# EAGLE design D12_1_0 (EAGLE 8.3.2)
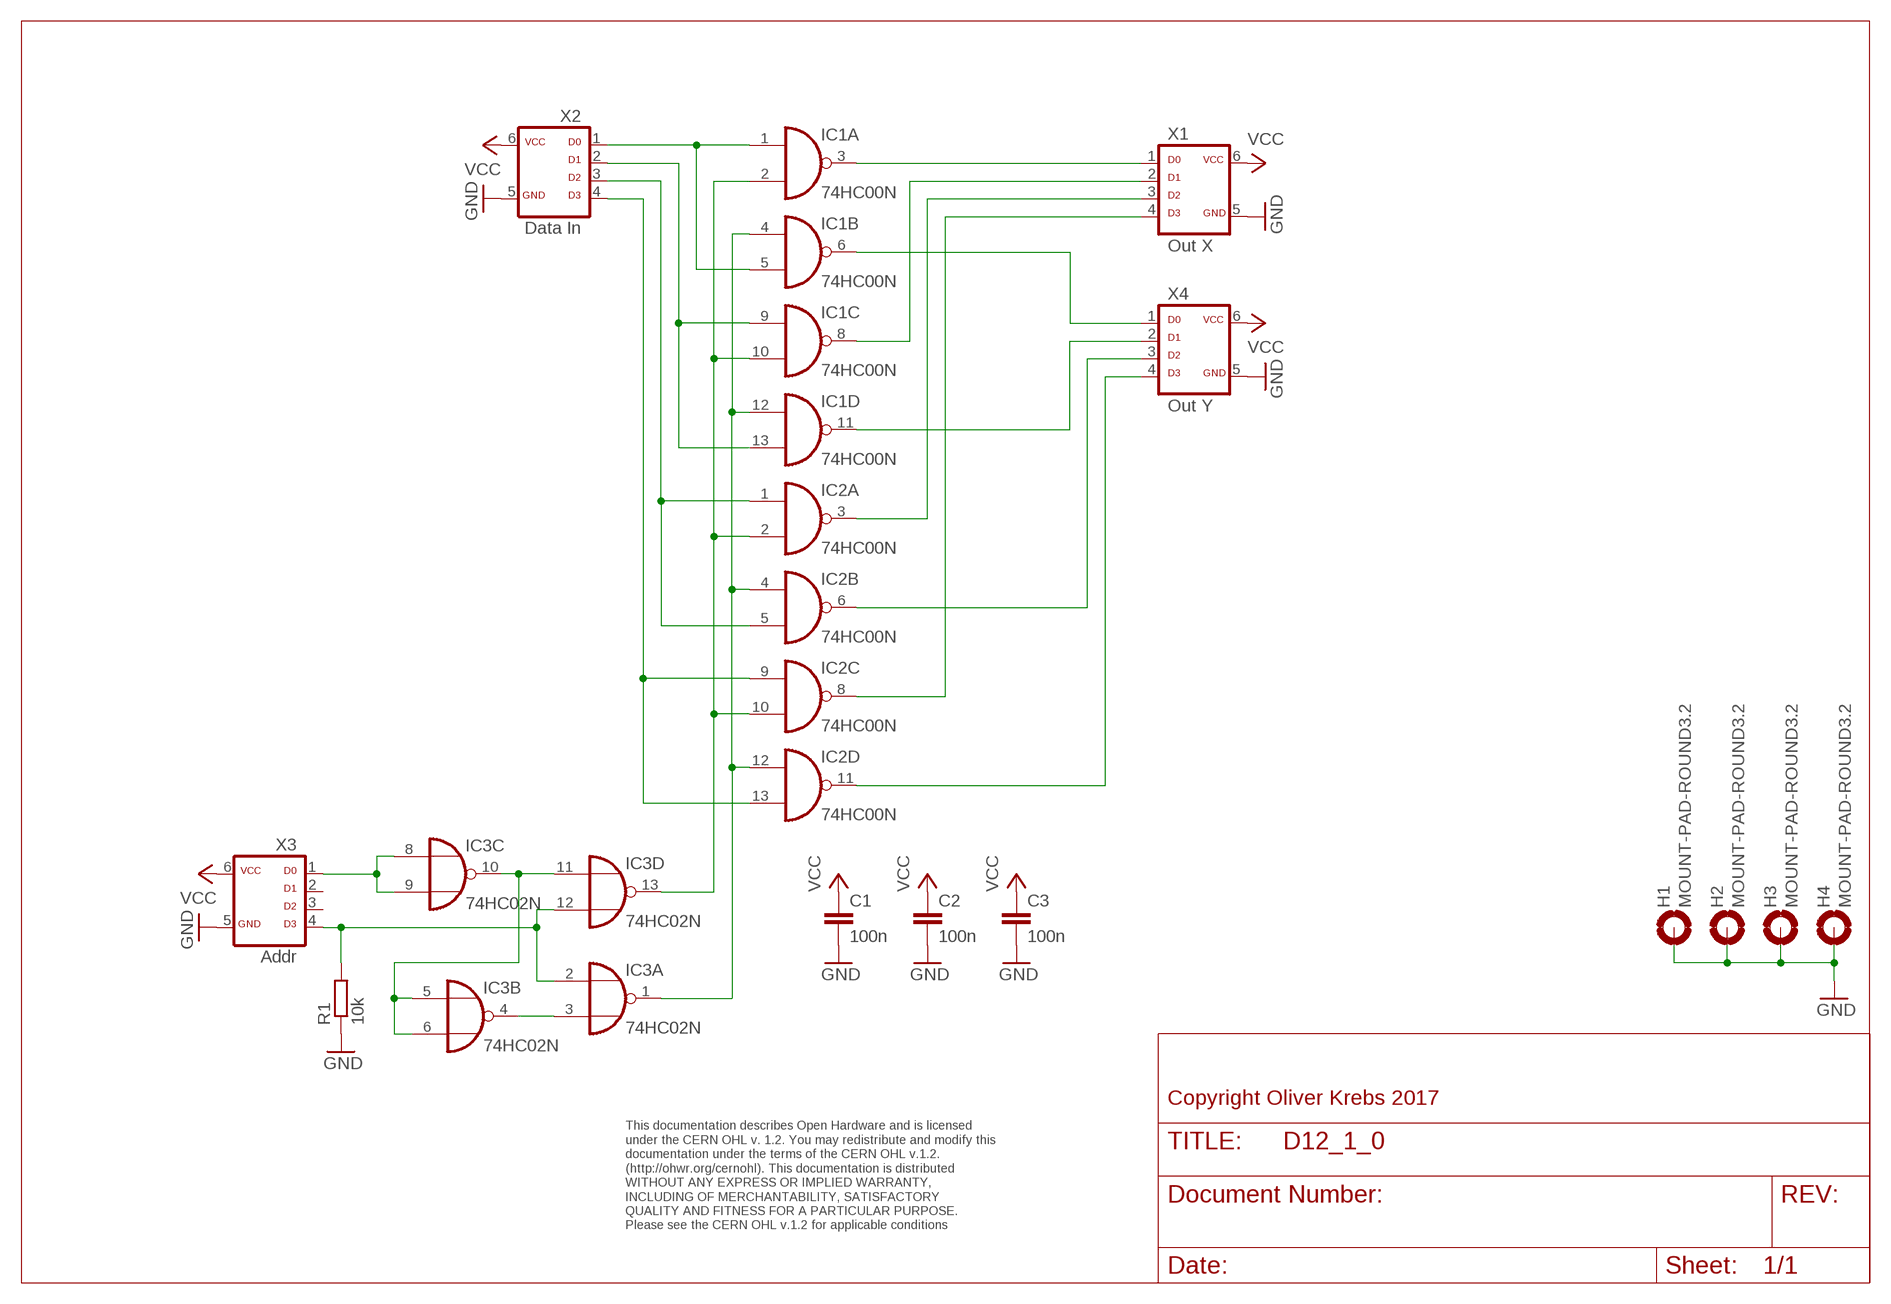
[diagram p0: schematic, sheet 1]

## Parts
C1  100n  C-EU050-025X075  [C050-025X075]
C2  100n  C-EU050-025X075  [C050-025X075]
C3  100n  C-EU050-025X075  [C050-025X075]
H1  MOUNT-PAD-ROUND3.2  [3,2-PAD]
H2  MOUNT-PAD-ROUND3.2  [3,2-PAD]
H3  MOUNT-PAD-ROUND3.2  [3,2-PAD]
H4  MOUNT-PAD-ROUND3.2  [3,2-PAD]
IC1  74HC00N  [DIL14]
IC2  74HC00N  [DIL14]
IC3  74HC02N  [DIL14]
R1  10k  R-EU_0207/10  [0207/10]
X1  Out X  ML6D  [ML-6]
X2  Data In  ML6D  [ML-6]
X3  Addr  ML6D  [ML-6]
X4  Out Y  ML6D  [ML-6]

## Nets
GND: C1.2 C2.2 C3.2 H1.B3,2(MOUNT) H2.B3,2(MOUNT) H3.B3,2(MOUNT) H4.B3,2(MOUNT) R1.1 X1.5 X2.5 X3.5 X4.5
N$1: IC1.3(A:O) X1.1
N$2: IC1.8(C:O) X1.2
N$3: IC2.3(A:O) X1.3
N$4: IC1.1(A:I0) IC1.5(B:I1) X2.1
N$5: IC1.9(C:I0) IC1.13(D:I1) X2.2
N$6: IC2.1(A:I0) IC2.5(B:I1) X2.3
N$7: IC2.9(C:I0) IC2.13(D:I1) X2.4
N$8: IC2.8(C:O) X1.4
N$9: IC1.6(B:O) X4.1
N$10: IC1.11(D:O) X4.2
N$11: IC2.6(B:O) X4.3
N$12: IC2.11(D:O) X4.4
N$13: IC3.5(B:I0) IC3.6(B:I1) IC3.10(C:O) IC3.11(D:I0)
N$14: IC3.2(A:I0) IC3.12(D:I1) R1.2 X3.4
N$15: IC1.2(A:I1) IC1.10(C:I1) IC2.2(A:I1) IC2.10(C:I1) IC3.13(D:O)
N$16: IC1.4(B:I0) IC1.12(D:I0) IC2.4(B:I0) IC2.12(D:I0) IC3.1(A:O)
N$17: IC3.3(A:I1) IC3.4(B:O)
N$19: IC3.8(C:I0) IC3.9(C:I1) X3.1
VCC: C1.1 C2.1 C3.1 X1.6 X2.6 X3.6 X4.6
Unconnected: X3.2 X3.3

## Notes on the sheet
- Copyright Oliver Krebs 2017
- This documentation describes Open Hardware and is licensed 
  under the CERN OHL v. 1.2. You may redistribute and modify this 
  documentation under the terms of the CERN OHL v.1.2. 
  (http://ohwr.org/cernohl). This documentation is distributed
  WITHOUT ANY EXPRESS OR IMPLIED WARRANTY, 
  INCLUDING OF MERCHANTABILITY, SATISFACTORY 
  QUALITY AND FITNESS FOR A PARTICULAR PURPOSE. 
  Please see the CERN OHL v.1.2 for applicable conditions

## Power pins joined to a net without a drawn wire
GND: IC1.7(P:GND) IC2.7(P:GND) IC3.7(P:GND)
VCC: IC1.14(P:VCC) IC2.14(P:VCC) IC3.14(P:VCC)

## Library data of the parts
C1-C3 = 01-my_rcl:C-EU: CAPACITOR, European symbol
H1-H4 = holes:MOUNT-PAD-ROUND: MOUNTING PAD, round
IC1 IC2 = 74xx-eu:74*00: Quad 2-input NAND gate
IC3 = 74xx-eu:74*02: Quad 2-input NOR gate
R1 = 01-my_rcl:R-EU_: RESISTOR, European symbol
X1-X4 = 01-my-con:ML6D

## Board
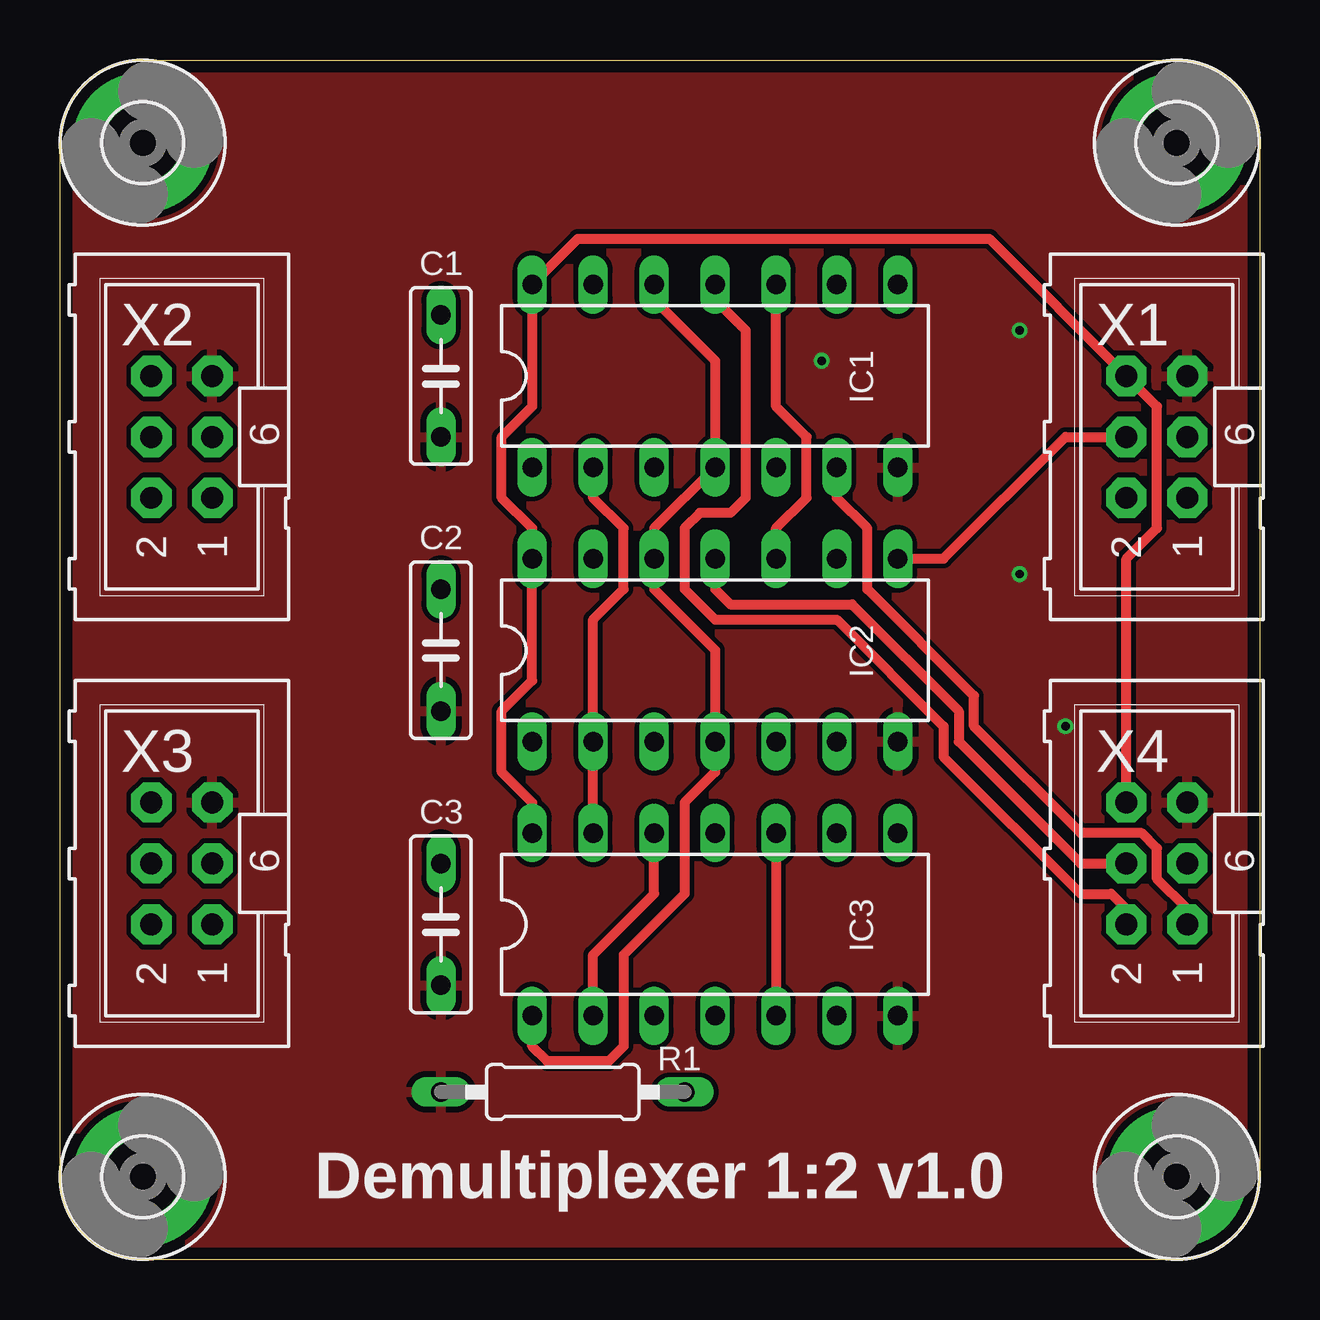
[diagram p1: board, top side]
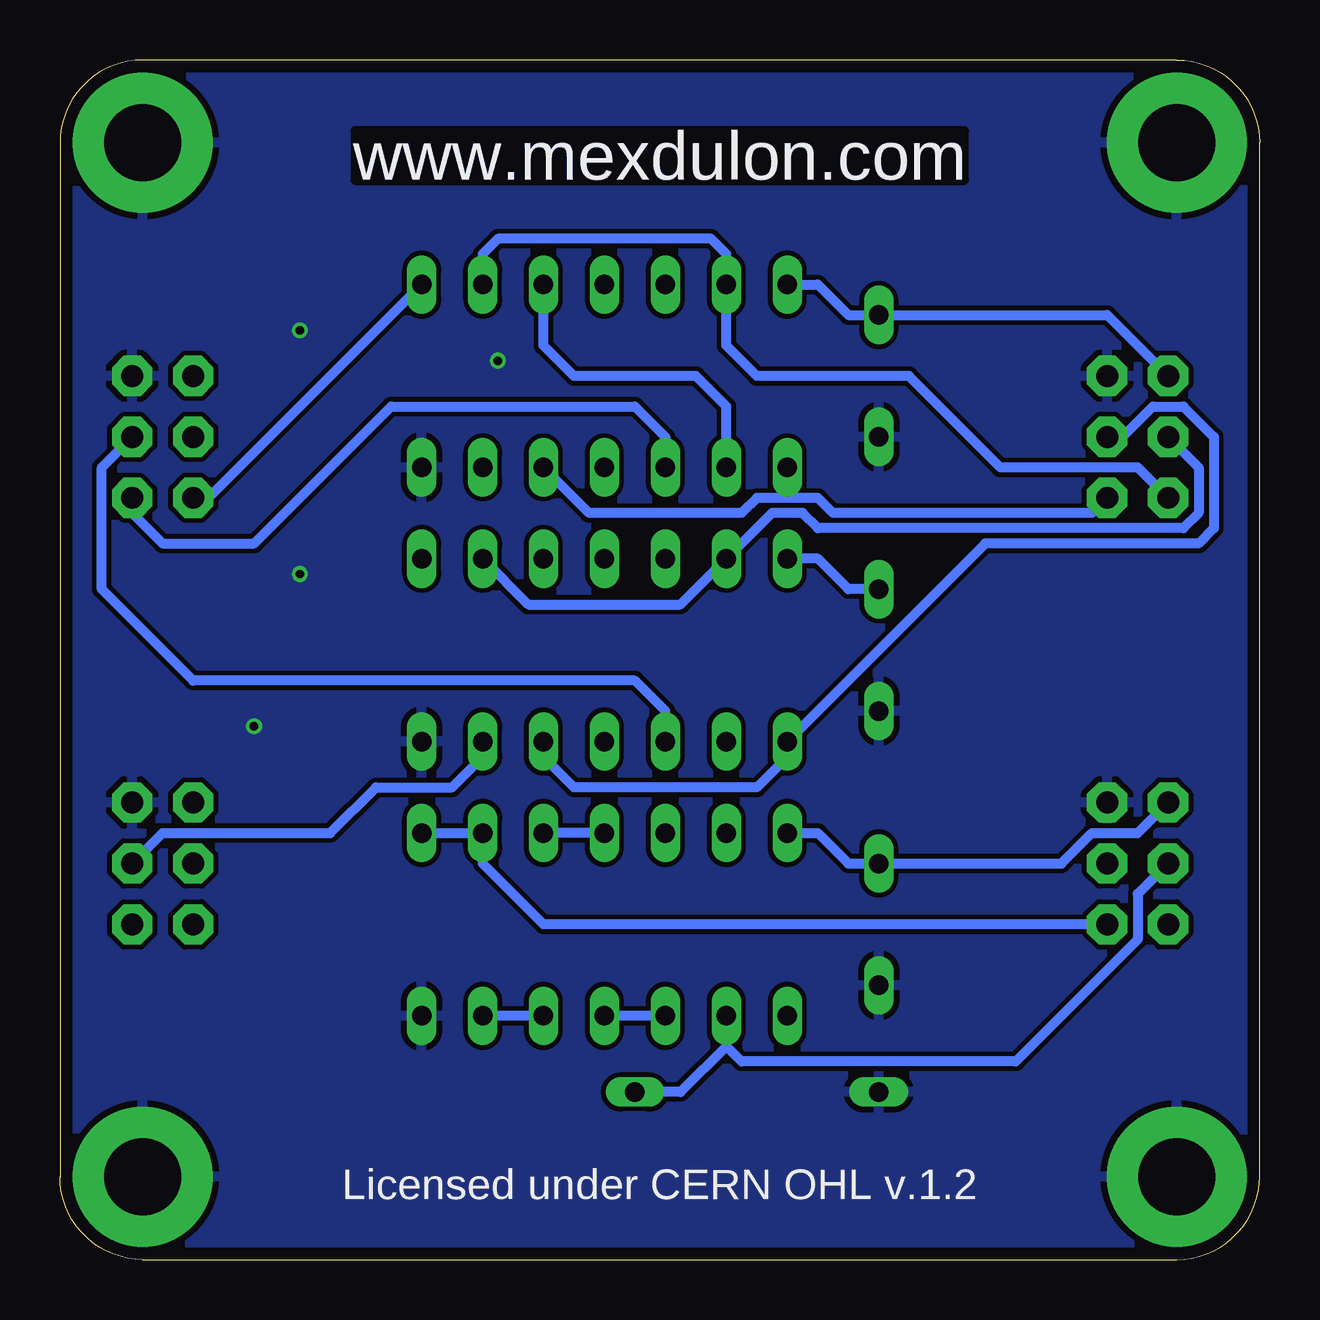
[diagram p2: board, bottom side, seen from below]

Size 50 x 50 mm. Coordinates in mm from the lower left corner, seen from the top.
Outline: 0,3.45 0,46.55 arc-90 3.45,50 46.55,50 arc-90 50,46.55 50,3.45 arc-90 46.55,0 3.45,0 arc-90 0,3.45
Copper layers (1*16): Top 0.035mm / dielectric 1.6mm / Bottom 0.035mm
Design rules "Elecrow_2-layer_PCB_eagle_rule": minimum track width 6mil, minimum drill 12mil, track to track 6mil, track to pad 6mil, pad to pad 6mil, via to via 8mil, smd to smd 0mil, copper to edge 20mil, drill to drill 10mil, minimum pad ring 6mil, minimum via ring 6mil, stop-mask expansion 0mil, vias tented up to drill 100mil, thermal gap 10mil

### Footprints (pad centres in the part's own frame; a part is rotated, then mirrored left to right if it is on the bottom)
C050-025X075 = drill 0.813 long: 1 -2.54,0; 2 2.54,0
3,2-PAD = drill 3.2 pad 5.842: B3,2 0,0
DIL14 = drill 0.813 long: 1 -7.62,-3.81; 2 -5.08,-3.81; 3 -2.54,-3.81; 4 0,-3.81; 5 2.54,-3.81; 6 5.08,-3.81; 7 7.62,-3.81; 8 7.62,3.81; 9 5.08,3.81; 10 2.54,3.81; 11 0,3.81; 12 -2.54,3.81; 13 -5.08,3.81; 14 -7.62,3.81
0207/10 = drill 0.813 long: 1 -5.08,0; 2 5.08,0
ML-6 = drill 0.914 pad 1.676 octagon: 1 -2.54,-1.27; 2 -2.54,1.27; 3 0,-1.27; 4 0,1.27; 5 2.54,-1.27; 6 2.54,1.27

### Placement (x,y rotation side)
C1  15.88,36.83 270 top
C2  15.88,25.4 270 top
C3  15.88,13.97 270 top
H1  3.45,3.45 0 top
H2  3.45,46.55 0 top
H3  46.55,46.55 0 top
H4  46.55,3.45 0 top
IC1  27.3,36.83 0 top
IC2  27.3,25.4 0 top
IC3  27.3,13.97 0 top
R1  20.95,6.99 0 top
X1  45.72,34.29 90 top
X2  5.08,34.29 90 top
X3  5.08,16.51 90 top
X4  45.72,16.51 90 top

### Tracks (layer width: path | path; a pad name or v marks a point on that pad's centre or on a via)
GND  (via drill 0.35)
  other vias: 40.01,28.57 40.01,38.73 31.75,37.47 41.91,22.23
  pour Bottom (isolate 0.203): 0,50.16 50.8,50.16 50.8,0 0,0
  pour Top (isolate 0.203): 0,50.16 50.8,50.16 50.8,0 0,0
N$1
  Bottom 0.406: X1.1 46.99,31.11 45.72,29.84 41.91,29.84 36.2,35.56 26.04,35.56 24.77,34.29 IC1.3
N$2
  Bottom 0.406: IC1.8 43.81,31.75 X1.2
N$3
  Bottom 0.406: IC2.3 24.77,22.86 26.04,24.13 44.45,24.13 48.26,27.94 48.26,33.02 X1.3
N$4
  Bottom 0.406: IC1.5 27.94,31.11 21.59,31.11 20.95,31.75 19.68,31.75 | IC1.1 19.68,31.75 | X2.1 6.99,31.11 17.78,31.11 18.41,31.75 19.68,31.75
N$5
  Bottom 0.406: IC1.9 32.38,41.91 31.75,42.55 22.86,42.55 22.23,41.91 IC1.13 22.23,38.1 20.95,36.83 14.61,36.83 10.79,33.02 5.08,33.02 X2.2
N$6
  Bottom 0.406: IC2.5 29.84,20.95 28.57,19.68 20.95,19.68 19.68,20.95 IC2.1 11.43,29.84 2.54,29.84 1.91,30.48 1.91,34.29 3.17,35.56 4.45,35.56 5.71,34.29 X2.3
N$7
  Bottom 0.406: IC2.9 30.48,27.3 24.13,27.3 IC2.13 20.32,31.11 19.05,31.11 18.41,30.48 3.17,30.48 2.54,31.11 2.54,33.02 X2.4
N$8
  Top 0.406: IC2.8 36.83,29.21 41.91,34.29 X1.4
N$9
  Top 0.406: X4.1 46.99,14.61 45.72,15.88 45.72,17.14 45.09,17.78 42.55,17.78 38.1,22.23 38.1,23.5 33.66,27.94 33.66,30.48 32.38,31.75 IC1.6
N$10
  Top 0.406: IC1.11 27.3,40.01 28.57,38.73 28.57,31.75 27.94,31.11 26.67,31.11 26.04,30.48 26.04,27.94 27.3,26.67 32.38,26.67 36.83,22.23 36.83,20.95 42.55,15.24 43.81,15.24 44.45,14.61 X4.2
N$11
  Bottom 0.406: X4.3 45.72,17.78 38.73,17.78 36.83,19.68 33.66,19.68 32.38,20.95 IC2.6
N$12
  Top 0.406: IC2.11 27.3,27.94 27.94,27.3 33.02,27.3 37.47,22.86 37.47,21.59 42.55,16.51 X4.4
N$13
  Top 0.406: IC3.10 IC3.5
  Bottom 0.406: IC3.5 IC3.6 | IC3.11 IC3.10
N$14
  Top 0.406: IC3.2 22.23,12.7 24.77,15.24 IC3.12
  Bottom 0.406: 22.23,8.89 IC3.2 | 22.23,8.89 24.13,6.99 R1.2 | X3.4 5.08,15.24 5.08,13.34 10.16,8.26 21.59,8.26 22.23,8.89
N$15
  Top 0.406: IC3.13 IC2.2 22.23,26.67 23.5,27.94 23.5,30.48 22.23,31.75 IC1.2 | IC2.10 29.84,30.48 31.11,31.75 31.11,34.29 29.84,35.56 IC1.10
  Bottom 0.406: IC1.2 22.23,35.56 23.5,36.83 28.57,36.83 29.84,38.1 IC1.10
N$16
  Top 0.406: IC1.12 24.77,40.01 27.3,37.47 IC1.4 24.77,30.48 IC2.12 24.77,27.94 27.3,25.4 IC2.4 27.3,20.32 26.04,19.05 26.04,15.24 23.5,12.7 23.5,8.89 22.86,8.26 20.32,8.26 19.68,8.89 IC3.1
N$17
  Bottom 0.406: IC3.3 IC3.4
N$19
  Bottom 0.406: X3.1 29.84,13.97 32.38,16.51 IC3.9 IC3.8
VCC
  Top 0.406: X4.6 44.45,29.21 45.72,30.48 45.72,35.56 X1.6 38.73,42.55 21.59,42.55 IC1.14 19.68,35.56 18.41,34.29 18.41,31.75 19.68,30.48 IC2.14 19.68,24.13 18.41,22.86 18.41,20.32 19.68,19.05 IC3.14
  Bottom 0.406: X3.6 5.08,17.78 6.99,17.78 8.26,16.51 C3.1 17.14,16.51 18.41,17.78 IC3.14 | C2.1 17.14,27.94 18.41,29.21 IC2.14 | IC1.14 18.41,40.64 17.14,39.37 C1.1 6.35,39.37 X2.6

### Text on the board
Bottom: www.mexdulon.com
tNames: Demultiplexer 1:2 v1.0
bNames: www.mexdulon.com | Licensed under CERN OHL v.1.2
200bmp: E:/Bilder/Elektronik/Modulion/Mexdulon/mexdulon_50x50_pcb.bmp